# Altium schematic sheet 7seg.SchDoc
size A
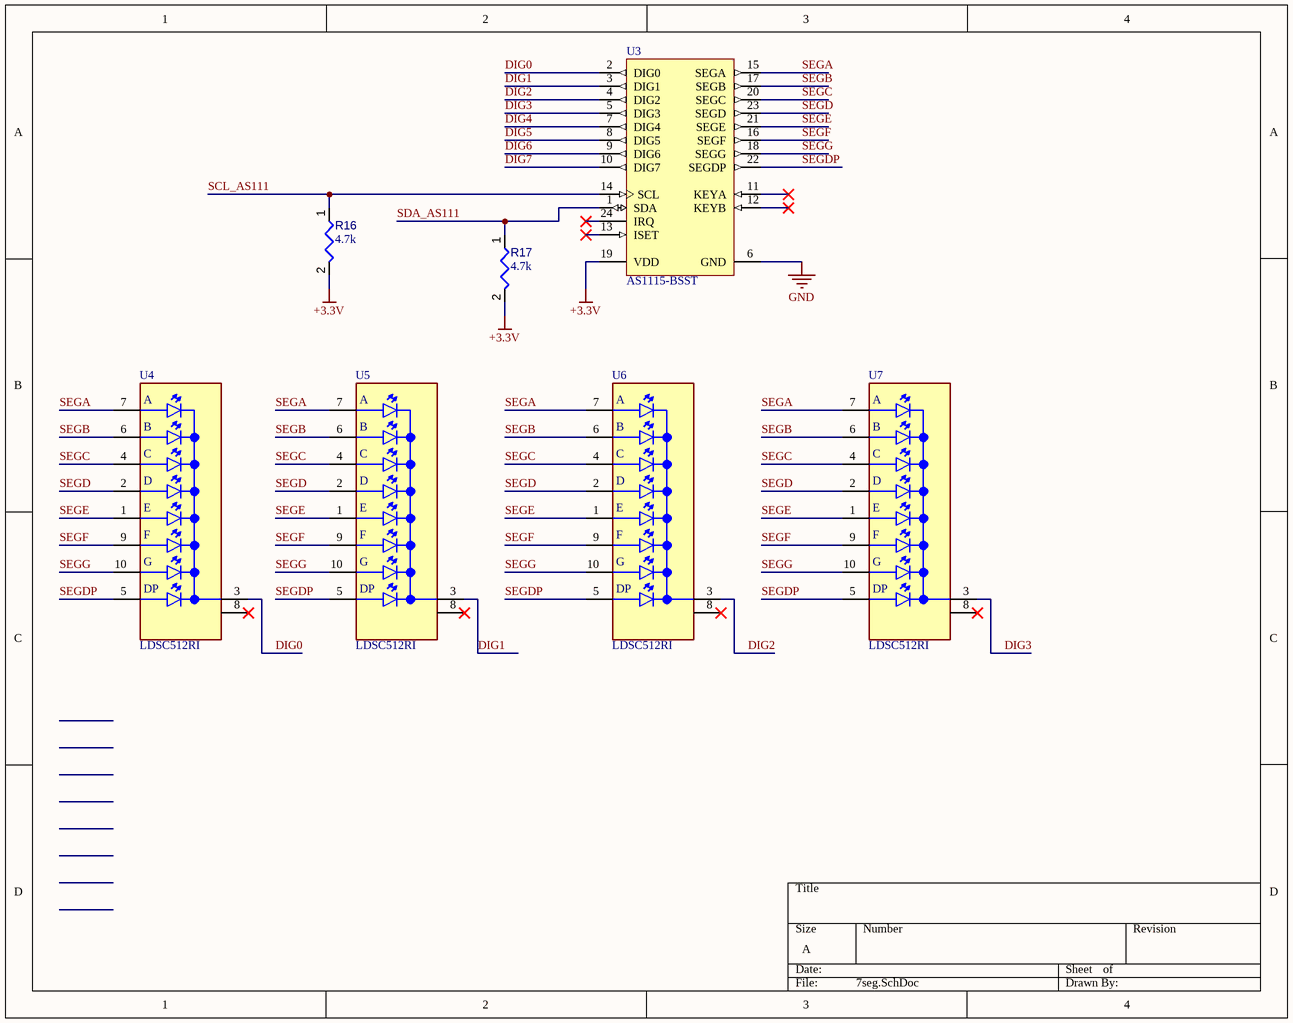
[diagram p0: 7seg.SchDoc]

## Parts
R16  value 4.7k  [RESC0402(1005)_L]  (hidden comment: Resistor 4K7  +/-1 % 0402 63 mW)
R17  value 4.7k  [RESC0402(1005)_L]  (hidden comment: Resistor 4K7  +/-1 % 0402 63 mW)
U3  AS1115-BSST  [AMS-QSOP-24-8645X3900DE_N]
U4  LDSC512RI  [LED_LDSC512RI]
U5  LDSC512RI  [LED_LDSC512RI]
U6  LDSC512RI  [LED_LDSC512RI]
U7  LDSC512RI  [LED_LDSC512RI]

## Nets
+3.3V: R16.2 R17.2 U3.19(VDD)
GND: U3.6(GND)
DIG0: U3.2(DIG0) U4.3(CC)
DIG1: U3.3(DIG1) U5.3(CC)
DIG2: U3.4(DIG2) U6.3(CC)
DIG3: U3.5(DIG3) U7.3(CC)
DIG4: U3.7(DIG4)
DIG5: U3.8(DIG5)
DIG6: U3.9(DIG6)
DIG7: U3.10(DIG7)
SCL_AS111: R16.1 U3.14(SCL)
SDA_AS111: R17.1 U3.1(SDA)
SEGA: U3.15(SEGA) U4.7(A) U5.7(A) U6.7(A) U7.7(A)
SEGB: U3.17(SEGB) U4.6(B) U5.6(B) U6.6(B) U7.6(B)
SEGC: U3.20(SEGC) U4.4(C) U5.4(C) U6.4(C) U7.4(C)
SEGD: U3.23(SEGD) U4.2(D) U5.2(D) U6.2(D) U7.2(D)
SEGDP: U3.22(SEGDP) U4.5(DP) U5.5(DP) U6.5(DP) U7.5(DP)
SEGE: U3.21(SEGE) U4.1(E) U5.1(E) U6.1(E) U7.1(E)
SEGF: U3.16(SEGF) U4.9(F) U5.9(F) U6.9(F) U7.9(F)
SEGG: U3.18(SEGG) U4.10(G) U5.10(G) U6.10(G) U7.10(G)

Not connected (* = marked no-connect by the designer): U3 11(KEYA)* 12(KEYB)* 13(ISET)* 24(IRQ)*; U4 8(CC)*; U5 8(CC)*; U6 8(CC)*; U7 8(CC)*

## Library data of the parts
R16 R17 = CMP-009-00158-3: Chip Resistor, 4,7 kOhms, +/-1 %, 63 mW, -55 to 155 degC, 0402; Power: 63mW; Tolerance: 1%; Max Operating Temperature: 155°C; Pins: 2; Min Operating Temperature: -55°C; Case/Package: 0402
U3 = CMP-001-0000-1: 8Digits Tape & Reel (TR) 8x (7Segment) 64LED SERIAL display driver 350muA 5.5V 8.66mm -40C~85C
U4-U7 = CMP-009-000000-1: .56IN. 7 SEGMENT SINGLE DISPLAY, 565NM GREEN, GRAY FACE, WHITE SEGMENTS, COMMON; MF: Lumex; MP: LDS-C512RI; Component Type: Standard; Package: None; Value: *; Pin Count: 10; Design Item ID: LDSC512RI; Check_prices: https://www.snapeda.com/parts/LDS-C512RI/Lumex/view-part/?ref=eda; Source: LDSC512RI.SchLib; SnapEDA_Link: https://www.snapeda.com/parts/LDS-C512RI/Lumex/view-part/?ref=snap